# Altium schematic sheet Sensors.SchDoc
size A4
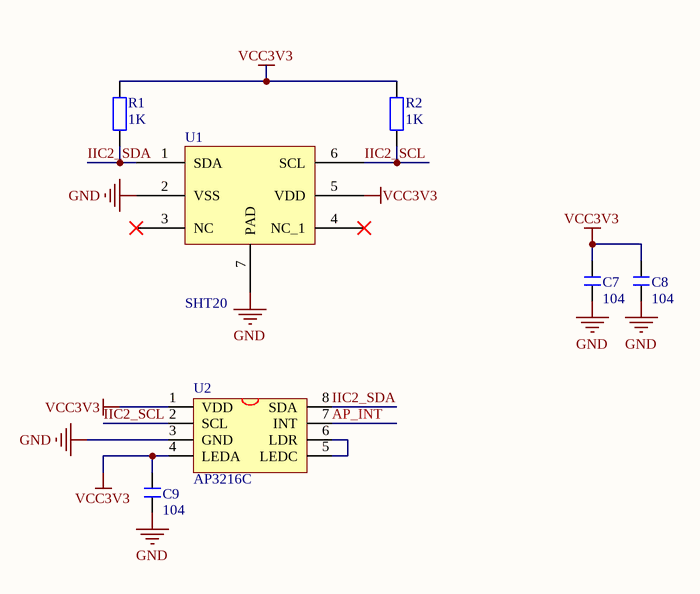
[diagram p0: Sensors.SchDoc]

## Parts
C7  104  [C 0603_L]
C8  104  [C 0603_L]
C9  104  [C 0603_L]
R1  1K  [R 0603_L]
R2  1K  [R 0603_L]
U1  SHT20  [sht20]
U2  AP3216C  [DFN8]

## Nets
GND: C7.2 C8.2 C9.2 U1.2(VSS) U1.7(PAD) U2.3(GND)
VCC3V3: C7.1 C8.1 C9.1 R1.1 R2.1 U1.5(VDD) U2.1(VDD) U2.4(LEDA)
AP_INT: U2.7(INT)
IIC2_SCL: R2.2 U1.6(SCL) U2.2(SCL)
IIC2_SDA: R1.2 U1.1(SDA) U2.8(SDA)
NetU2_5: U2.5(LEDC) U2.6(LDR)

Not connected (* = marked no-connect by the designer): U1 3(NC)* 4(NC_1)*

## Library data of the parts
C7-C9 = C: 无极性贴片电容; 版权归属: 源创客; BOM名称: 无极性贴片电容; 学习资源: www.ooocke.com
R1 R2 = R: 贴片电阻; 版权归属: 源创客; BOM名称: 贴片电阻; 学习资源: www.ooocke.com
U2 = AP3216C: ALS+PS Sensor